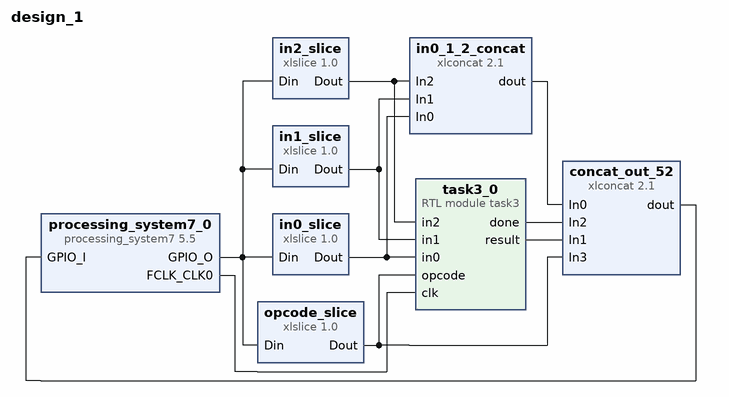
[diagram p0: block diagram of the top level]
# Vivado block design design_1, xc7z020clg400-1, Vivado 2022.2
create_bd_design design_1

create_bd_cell -type ip -vlnv xilinx.com:ip:processing_system7:5.5 processing_system7_0
set_property -dict [list \
  CONFIG.PCW_APU_PERIPHERAL_FREQMHZ 650 \
  CONFIG.PCW_CRYSTAL_PERIPHERAL_FREQMHZ 50 \
  CONFIG.PCW_ENET0_ENET0_IO {MIO 16 .. 27} \
  CONFIG.PCW_ENET0_GRP_MDIO_ENABLE 1 \
  CONFIG.PCW_ENET0_GRP_MDIO_IO {MIO 52 .. 53} \
  CONFIG.PCW_ENET0_PERIPHERAL_ENABLE 1 \
  CONFIG.PCW_ENET0_RESET_ENABLE 1 \
  CONFIG.PCW_ENET0_RESET_IO {MIO 9} \
  CONFIG.PCW_ENET_RESET_ENABLE 1 \
  CONFIG.PCW_ENET_RESET_SELECT {Share reset pin} \
  CONFIG.PCW_FPGA0_PERIPHERAL_FREQMHZ 100 \
  CONFIG.PCW_FPGA1_PERIPHERAL_FREQMHZ 50 \
  CONFIG.PCW_GPIO_EMIO_GPIO_ENABLE 1 \
  CONFIG.PCW_GPIO_EMIO_GPIO_IO 52 \
  CONFIG.PCW_GPIO_EMIO_GPIO_WIDTH 52 \
  CONFIG.PCW_GPIO_MIO_GPIO_ENABLE 1 \
  CONFIG.PCW_GPIO_MIO_GPIO_IO MIO \
  CONFIG.PCW_I2C_RESET_ENABLE 0 \
  CONFIG.PCW_PERIPHERAL_BOARD_PRESET part0 \
  CONFIG.PCW_PRESET_BANK1_VOLTAGE {LVCMOS 1.8V} \
  CONFIG.PCW_QSPI_GRP_FBCLK_ENABLE 1 \
  CONFIG.PCW_QSPI_GRP_FBCLK_IO {MIO 8} \
  CONFIG.PCW_QSPI_GRP_SINGLE_SS_ENABLE 1 \
  CONFIG.PCW_QSPI_GRP_SINGLE_SS_IO {MIO 1 .. 6} \
  CONFIG.PCW_QSPI_PERIPHERAL_ENABLE 1 \
  CONFIG.PCW_QSPI_QSPI_IO {MIO 1 .. 6} \
  CONFIG.PCW_SD0_GRP_CD_ENABLE 1 \
  CONFIG.PCW_SD0_GRP_CD_IO {MIO 47} \
  CONFIG.PCW_SD0_GRP_WP_ENABLE 0 \
  CONFIG.PCW_SD0_PERIPHERAL_ENABLE 1 \
  CONFIG.PCW_SD0_SD0_IO {MIO 40 .. 45} \
  CONFIG.PCW_SDIO_PERIPHERAL_FREQMHZ 50 \
  CONFIG.PCW_SINGLE_QSPI_DATA_MODE x4 \
  CONFIG.PCW_UART0_PERIPHERAL_ENABLE 1 \
  CONFIG.PCW_UART0_UART0_IO {MIO 14 .. 15} \
  CONFIG.PCW_UART1_PERIPHERAL_ENABLE 0 \
  CONFIG.PCW_UART_PERIPHERAL_FREQMHZ 100 \
  CONFIG.PCW_UIPARAM_DDR_BUS_WIDTH {16 Bit} \
  CONFIG.PCW_UIPARAM_DDR_FREQ_MHZ 525 \
  CONFIG.PCW_UIPARAM_DDR_PARTNO {MT41J256M16 RE-125} \
  CONFIG.PCW_USB0_PERIPHERAL_ENABLE 1 \
  CONFIG.PCW_USB0_RESET_ENABLE 1 \
  CONFIG.PCW_USB0_RESET_IO {MIO 46} \
  CONFIG.PCW_USB0_USB0_IO {MIO 28 .. 39} \
  CONFIG.PCW_USB_RESET_ENABLE 1 \
  CONFIG.PCW_USB_RESET_SELECT {Share reset pin} \
  CONFIG.PCW_USE_AXI_NONSECURE 1 \
  CONFIG.PCW_USE_M_AXI_GP0 0 \
] [get_bd_cells processing_system7_0]
# 479 more settings of processing_system7_0 are not shown: defaults, MIO pin electricals, DDR timing, and values the tool derives
create_bd_cell -type ip -vlnv xilinx.com:ip:xlslice:1.0 opcode_slice
set_property -dict {CONFIG.DIN_FROM 51 CONFIG.DIN_TO 49 CONFIG.DIN_WIDTH 52} [get_bd_cells opcode_slice]
create_bd_cell -type ip -vlnv xilinx.com:ip:xlslice:1.0 in2_slice
set_property -dict {CONFIG.DIN_FROM 23 CONFIG.DIN_TO 16 CONFIG.DIN_WIDTH 24} [get_bd_cells in2_slice]
create_bd_cell -type ip -vlnv xilinx.com:ip:xlslice:1.0 in1_slice
set_property -dict {CONFIG.DIN_FROM 15 CONFIG.DIN_TO 8 CONFIG.DIN_WIDTH 16} [get_bd_cells in1_slice]
create_bd_cell -type ip -vlnv xilinx.com:ip:xlslice:1.0 in0_slice
set_property -dict {CONFIG.DIN_FROM 7 CONFIG.DIN_WIDTH 8} [get_bd_cells in0_slice]
create_bd_cell -type ip -vlnv xilinx.com:ip:xlconcat:2.1 concat_out_52
set_property -dict [list \
  CONFIG.IN0_WIDTH 24 \
  CONFIG.IN1_WIDTH 24 \
  CONFIG.IN2_WIDTH 1 \
  CONFIG.IN3_WIDTH 3 \
  CONFIG.NUM_PORTS 4 \
] [get_bd_cells concat_out_52]
create_bd_cell -type ip -vlnv xilinx.com:ip:xlconcat:2.1 in0_1_2_concat
set_property -dict {CONFIG.IN0_WIDTH 8 CONFIG.IN1_WIDTH 8 CONFIG.IN2_WIDTH 8 CONFIG.NUM_PORTS 3} [get_bd_cells in0_1_2_concat]
create_bd_cell -type module -reference task3 task3_0

# ---- connections ----

connect_bd_net [get_bd_pins concat_out_52/dout] [get_bd_pins processing_system7_0/GPIO_I]
connect_bd_net [get_bd_pins in0_1_2_concat/dout] [get_bd_pins concat_out_52/In0]
connect_bd_net [get_bd_pins in0_slice/Dout] [get_bd_pins in0_1_2_concat/In0] [get_bd_pins task3_0/in0]
connect_bd_net [get_bd_pins in1_slice/Dout] [get_bd_pins in0_1_2_concat/In1] [get_bd_pins task3_0/in1]
connect_bd_net [get_bd_pins in2_slice/Dout] [get_bd_pins in0_1_2_concat/In2] [get_bd_pins task3_0/in2]
connect_bd_net [get_bd_pins opcode_slice/Dout] [get_bd_pins concat_out_52/In3] [get_bd_pins task3_0/opcode]
connect_bd_net [get_bd_pins processing_system7_0/FCLK_CLK0] [get_bd_pins task3_0/clk]
connect_bd_net [get_bd_pins processing_system7_0/GPIO_O] \
  [get_bd_pins opcode_slice/Din] [get_bd_pins in2_slice/Din] [get_bd_pins in1_slice/Din] [get_bd_pins in0_slice/Din]
connect_bd_net [get_bd_pins task3_0/done] [get_bd_pins concat_out_52/In2]
connect_bd_net [get_bd_pins task3_0/result] [get_bd_pins concat_out_52/In1]

validate_bd_design
save_bd_design
